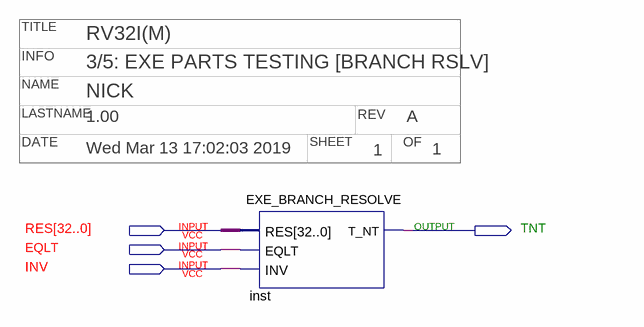
[diagram p0: schematic sheet]
// Quartus schematic EXE_BRANCH_RESOLVETEST.bdf as structural Verilog: 1 symbols, 4 pins
// Title block: TITLE: RV32I(M); INFO: 3/5: EXE PARTS TESTING [BRANCH RSLV]; NAME: NICK; LASTNAME: 1.00; REV: A; DATE: Wed Mar 13 17:02:03 2019; SHEET: 1; OF: 1
module EXE_BRANCH_RESOLVETEST (
  input  [32:0] RES,
  input  EQLT,
  input  INV,
  output TNT
);

  EXE_BRANCH_RESOLVE inst (.RES(RES), .EQLT(EQLT), .INV(INV), .T_NT(TNT));
endmodule
